# Altium schematic sheet 2312_RFID.SchDoc
size A3; Author: Miguel Santos; Organization: ETML-ES; Address1: Avenue Recordon 1; Address2: 1004 Lausanne; Address3: Switzerland; SheetNumber: 6; SheetTotal: 7; Version: 1.0
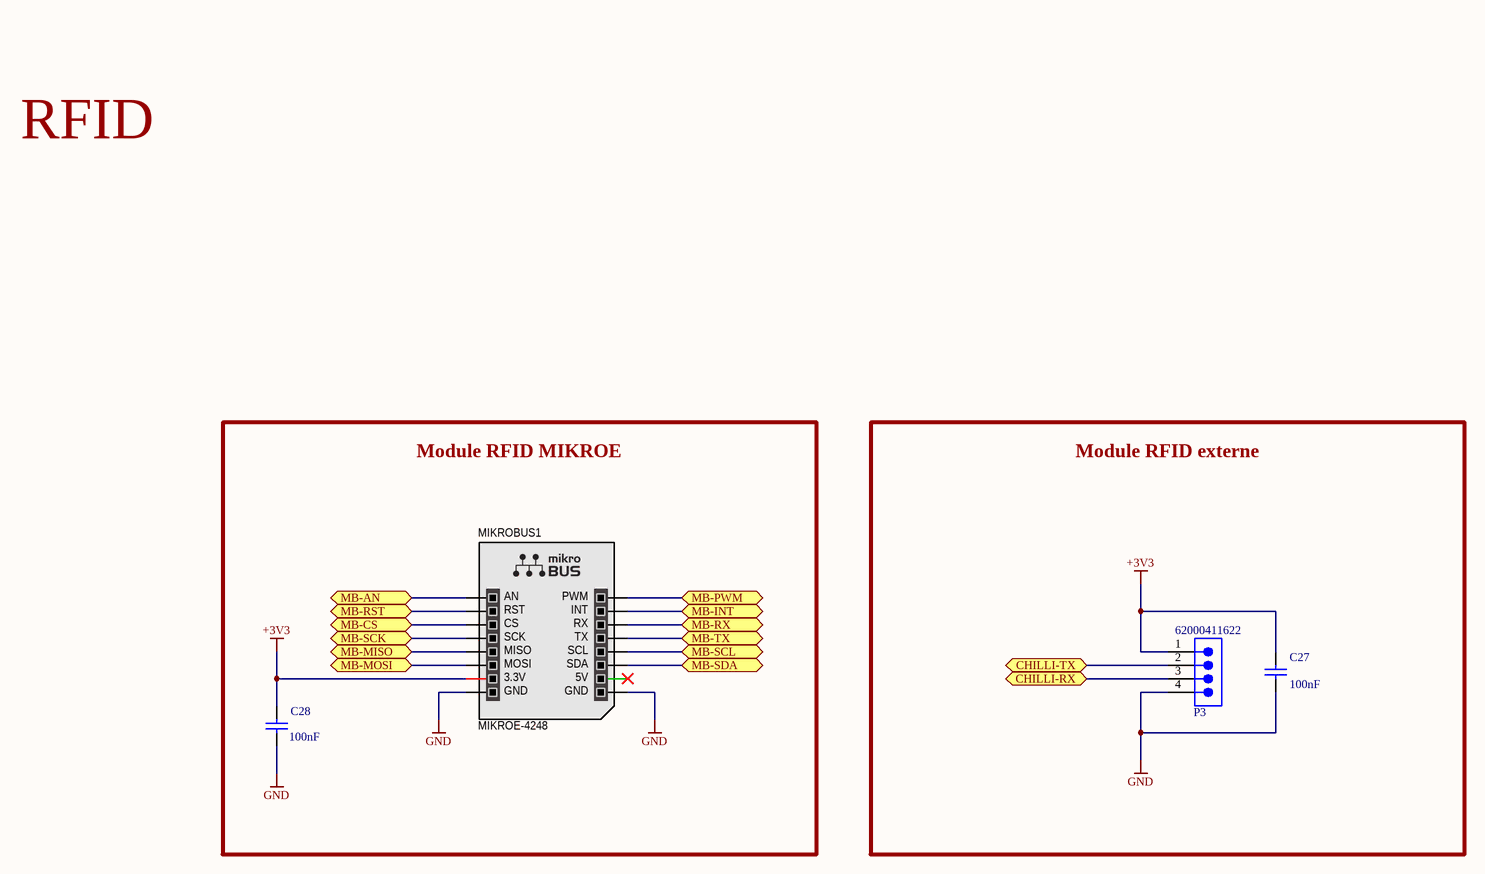
[diagram p0: 2312_RFID.SchDoc]

## Parts
C27  Capacitance: 100nF  [WCAP-CSGP_0805_L2W1.25H0.8_Reflow]  (hidden comment: 885012207016)
C28  Capacitance: 100nF  [WCAP-CSGP_0805_L2W1.25H0.8_Reflow]  (hidden comment: 885012207016)
MIKROBUS1  MIKROE-4248  [MIKROBUS HOST SMD 16 - Black]
P3  62000411622  [62000411622]

## Blocks framed on the sheet
Module RFID MIKROE: C28 MIKROBUS1
Module RFID externe: C27 P3

## Ports
CHILLI-RX (bidir), CHILLI-TX (bidir), MB-AN (bidir), MB-CS (bidir), MB-INT (bidir), MB-MISO (bidir), MB-MOSI (bidir), MB-PWM (bidir), MB-RST (bidir), MB-RX (bidir), MB-SCK (bidir), MB-SCL (bidir), MB-SDA (bidir), MB-TX (bidir)

## Nets
+3V3: C27.2 C28.2 MIKROBUS1.7(3.3V) P3.1
GND: C27.1 C28.1 MIKROBUS1.8(GND) MIKROBUS1.9(GND) P3.4
CHILLI-RX: P3.3 ; port CHILLI-RX
CHILLI-TX: P3.2 ; port CHILLI-TX
MB-AN: MIKROBUS1.1(AN) ; port MB-AN
MB-CS: MIKROBUS1.3(CS) ; port MB-CS
MB-INT: MIKROBUS1.15(INT) ; port MB-INT
MB-MISO: MIKROBUS1.5(MISO) ; port MB-MISO
MB-MOSI: MIKROBUS1.6(MOSI) ; port MB-MOSI
MB-PWM: MIKROBUS1.16(PWM) ; port MB-PWM
MB-RST: MIKROBUS1.2(RST) ; port MB-RST
MB-RX: MIKROBUS1.14(RX) ; port MB-RX
MB-SCK: MIKROBUS1.4(SCK) ; port MB-SCK
MB-SCL: MIKROBUS1.12(SCL) ; port MB-SCL
MB-SDA: MIKROBUS1.11(SDA) ; port MB-SDA
MB-TX: MIKROBUS1.13(TX) ; port MB-TX

Not connected (* = marked no-connect by the designer): MIKROBUS1 10(5V)*

## Notes on the sheet
- RFID
- Fichier :
- a
- Date :
- Heure :
- Version :
- Auteur :
- Modif.
- b
- c
- d
- Projet :
- No :
- Nb feuilles
- Feuille n°
- Chemin :

## Library data of the parts
C27 C28 = 885012207016: WCAP-CSGP Multilayer Ceramic Chip Capacitor, General Purpose, size 0805, X7R, 100nF, 10VDC; Manufacturer: Wurth Elektronik; Case/Size Code: 0805; Capacitance Tolerance: +/-10%; Dissipation Factor: 5%; Insulation Resistance: 5GΩ; Rated Voltage (DC): 10V; Technical Reference: X7R0805104K010DFCT10000; Manufacturer Part Number: 885012207016; Category: Multilayer Ceramic Chip Capacitors; Match Code: WCAP-CSGP; ComponentLink1Description: Website Link; ComponentLink1URL: https://www.we-online.com/redexpert/article/885012207016?ad; ComponentLink2Description: Datasheet Link; ComponentLink2URL: https://www.we-online.com/redexpert/spec/885012207016?ad; Mount: Surface Mount; Operating Temperature Max: 125°C; Operating Temperature Min: -55°C; Packaging: Tape and Reel; Length: 2mm; Width: 1.25mm; Height: 0.8mm; Ceramic Type: X7R
MIKROBUS1 = MIKROBUS HOST CONN: mikroBUS socket
P3 = 62000411622: WR-WTB Male Vertical Shrouded Header, pitch 2mm, 4pins; Manufacturer: Wurth Elektronik; Contact Resistance: 20mΩ; Rated Current: 2A; Working Voltage: 125VAC; Withstanding Voltage: 800VAC; ComponentLink1Description: Website Link; ComponentLink1URL: https://www.we-online.com/redexpert/article/62000411622?ad; ComponentLink2Description: Datasheet Link; ComponentLink2URL: https://www.we-online.com/redexpert/spec/62000411622?ad; Manufacturer Part Number: 62000411622; Category: Wire-to-Board Connectors; Match Code: WR-WTB; Mount: Through Hole; Operating Temperature Max: 85°C; Operating Temperature Min: -25°C; Packaging: Bag; Length: 10mm; Width: 4.7mm; Height: 6.1mm; Gender: Male; Number of Pins: 4; Number of Rows: 1; Orientation: Vertical; Pitch: 2mm